# EAGLE design RAMPSSB (EAGLE 8.2.2)
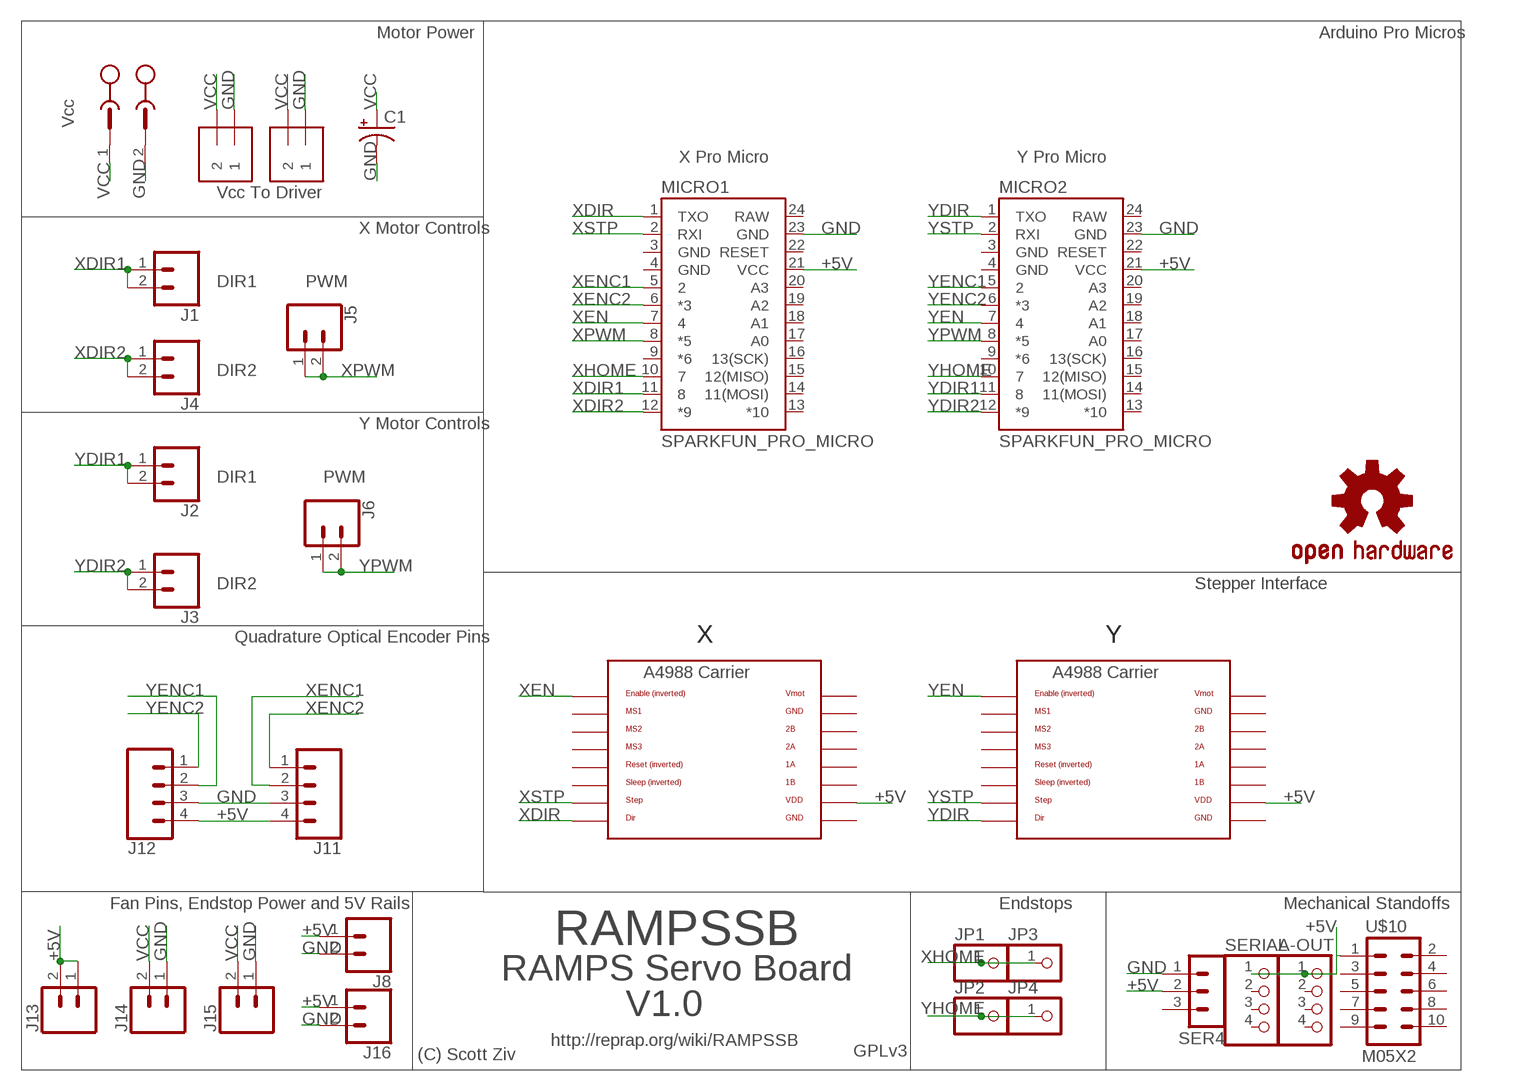
[diagram p0: schematic, sheet 1]

## Parts
A-OUT  PINHD-1X4  [1X04]
C1  CPOL-USE2.5-6  [E2,5-6]
J1  CONN_02  [1X02]
J2  CONN_02  [1X02]
J3  CONN_02  [1X02]
J4  CONN_02  [1X02]
J5  CONN_02  [1X02]
J6  CONN_02  [1X02]
J7  OSTTH020160  [EDSTL130-02]
J8  CONN_02  [1X02]
J9  1X2-3.5MM  [1X2-3.5MM]
J10  1X2-3.5MM  [1X2-3.5MM]
J11  CONN_04  [1X04]
J12  CONN_04  [1X04]
J13  CONN_02  [1X02]
J14  CONN_02  [1X02]
J15  CONN_02  [1X02]
J16  CONN_02  [1X02]
JP1  PINHD-1X1  [1X01]
JP2  PINHD-1X1  [1X01]
JP3  PINHD-1X1  [1X01]
JP4  PINHD-1X1  [1X01]
LOGO1  OSHW-LOGOL  [OSHW-LOGO-L]
MICRO1  SPARKFUN_PRO_MICRO  [SPARKFUN_PRO_MICRO]
MICRO2  SPARKFUN_PRO_MICRO  [SPARKFUN_PRO_MICRO]
SER4  3PIN-HEADER  [3PIN-HEADER]
SERIAL  PINHD-1X4  [1X04]
U$6  A4988BREAKOUT  [A4988BREAKOUT]
U$7  A4988BREAKOUT  [A4988BREAKOUT]
U$10  M05X2  [2X5]

## Nets
+5V: A-OUT.1 J8.1 J11.4 J12.4 J13.1 J13.2 J16.1 MICRO1.21(VCC) MICRO2.21(VCC) SER4.2 SERIAL.1 U$6.VDD U$7.VDD U$10.1
GND: C1.- J7.2 J8.2 J9.1 J10.1 J11.3 J12.3 J14.1 J15.1 J16.2 MICRO1.23(GND) MICRO2.23(GND) SER4.1
VCC: C1.+ J7.1 J9.2 J10.2 J14.2 J15.2
XDIR: MICRO1.1(TXO) U$6.DIR
XDIR1: J1.1 J1.2 MICRO1.11
XDIR2: J4.1 J4.2 MICRO1.12(*9)
XEN: MICRO1.7 U$6.EN
XENC1: J11.2 MICRO1.5
XENC2: J11.1 MICRO1.6(*3)
XHOME: JP1.1 JP3.1 MICRO1.10
XPWM: J5.1 J5.2 MICRO1.8(*5)
XSTP: MICRO1.2(RXI) U$6.STEP
YDIR: MICRO2.1(TXO) U$7.DIR
YDIR1: J2.1 J2.2 MICRO2.11
YDIR2: J3.1 J3.2 MICRO2.12(*9)
YEN: MICRO2.7 U$7.EN
YENC1: J12.2 MICRO2.5
YENC2: J12.1 MICRO2.6(*3)
YHOME: JP2.1 JP4.1 MICRO2.10
YPWM: J6.1 J6.2 MICRO2.8(*5)
YSTP: MICRO2.2(RXI) U$7.STEP
Unconnected: A-OUT.2 A-OUT.3 A-OUT.4 MICRO1.9(*6) MICRO1.13(*10) MICRO1.14(11(MOSI)) MICRO1.15(12(MISO)) MICRO1.16(13(SCK)) MICRO1.17(A0) MICRO1.18(A1) MICRO1.19(A2) MICRO1.20(A3) MICRO1.22(RESET) MICRO2.9(*6) MICRO2.13(*10) MICRO2.14(11(MOSI)) MICRO2.15(12(MISO)) MICRO2.16(13(SCK)) MICRO2.17(A0) MICRO2.18(A1) MICRO2.19(A2) MICRO2.20(A3) MICRO2.22(RESET) SER4.3 SERIAL.2 SERIAL.3 SERIAL.4 U$6.1A U$6.1B U$6.2A U$6.2B U$6.MS1 U$6.MS2 U$6.MS3 U$6.RST U$6.SLP(SLEEP) U$7.1A U$7.1B U$7.2A U$7.2B U$7.MS1 U$7.MS2 U$7.MS3 U$7.RST U$7.SLP(SLEEP) U$10.2 U$10.3 U$10.4 U$10.5 U$10.6 U$10.7 U$10.8 U$10.9 U$10.10

## Notes on the sheet
- Motor Power | Arduino Pro Micros
- Vcc
- X Pro Micro | Y Pro Micro
- Vcc To Driver
- X Motor Controls
- DIR1 | PWM
- DIR2
- Y Motor Controls
- DIR1 | PWM
- DIR2 | Stepper Interface
- Quadrature Optical Encoder Pins | X | Y
- Fan Pins, Endstop Power and 5V Rails | Endstops | Mechanical Standoffs
- RAMPSSB
- RAMPS Servo Board
- V1.0
- http://reprap.org/wiki/RAMPSSB
- (C) Scott Ziv | GPLv3

## Power pins joined to a net without a drawn wire
GND: MICRO1.3(GND) MICRO1.4(GND) MICRO2.3(GND) MICRO2.4(GND) U$6.GND U$6.GND@0(GND) U$7.GND U$7.GND@0(GND)
RAW: MICRO1.24(RAW) MICRO2.24(RAW)
VMOT: U$6.VMOT U$7.VMOT

## Library data of the parts
A-OUT SERIAL = RepRapjr:PINHD-1X4: PIN HEADER
C1 = adafruit:CPOL-US: POLARIZED CAPACITOR, American symbol
J1-J6 J8 J13-J16 = SparkFun-Retired:CONN_02: Multi connection point. Often used as Generic Header-pin footprint for 0.1 inch spaced/style header connections On any of the 0.1 inch spaced packages, you can populate with these: Break Away Headers - Straight <https://www.sparkfun.com/products/116> (PRT-00116) Break Away Male Headers - Right Angle <https://www.sparkfun.com/products/553> (PRT-00553) Female Headers <https://www.sparkfun.com/products/115> (PRT-00115) Break Away Headers - Machine Pin <https://www.sparkfun.com/products/117> (PRT-00117) Break Away Female Headers - Swiss Machine Pin <https://www.sparkfun.com/products/743> (PRT-00743) For SCREWTERMINALS and SPRING TERMINALS visit here: Screw Terimnals on SparkFun.com <https://www.sparkfun.com/search/results?term=Screw+Terminals> (5mm/3.5mm/2.54mm spacing) This device is also useful as a general connection point to wire up your design to another part of your project. Our various solder wires solder well into these plated through hole pads. Hook-Up Wire - Assortment (Stranded, 22 AWG) <https://www.sparkfun.com/products/11375> (PRT-11375) Hook-Up Wire - Assortment (Solid Core, 22 AWG) <https://www.sparkfun.com/products/11367> (PRT-11367) View the entire wire category on our website here <https://www.sparkfun.com/categories/141> Special notes: Molex polarized connector foot print use with: PRT-08233 with associated crimp pins and housings. 2.54_SCREWTERM for use with PRT-10571. 3.5mm Screw Terminal footprints for PRT-08084 5mm Screw Terminal footprints for use with PRT-08432
J7 = con-ost:OSTTH020160: 5mm Terminal Header
J9 J10 = adafruit:1X2: 3.5mm Terminal block http://www.ladyada.net/library/pcb/eaglelibrary.html
J11 J12 = SparkFun-Connectors:CONN_04: Multi connection point. Often used as Generic Header-pin footprint for 0.1 inch spaced/style header connections On any of the 0.1 inch spaced packages, you can populate with these: Break Away Headers - Straight <https://www.sparkfun.com/products/116> (PRT-00116) Break Away Male Headers - Right Angle <https://www.sparkfun.com/products/553> (PRT-00553) Female Headers <https://www.sparkfun.com/products/115> (PRT-00115) Break Away Headers - Machine Pin <https://www.sparkfun.com/products/117> (PRT-00117) Break Away Female Headers - Swiss Machine Pin <https://www.sparkfun.com/products/743> (PRT-00743) For SCREWTERMINALS and SPRING TERMINALS visit here: Screw Terimnals on SparkFun.com <https://www.sparkfun.com/search/results?term=Screw+Terminals> (5mm/3.5mm/2.54mm spacing) This device is also useful as a general connection point to wire up your design to another part of your project. Our various solder wires solder well into these plated through hole pads. Hook-Up Wire - Assortment (Stranded, 22 AWG) <https://www.sparkfun.com/products/11375> (PRT-11375) Hook-Up Wire - Assortment (Solid Core, 22 AWG) <https://www.sparkfun.com/products/11367> (PRT-11367) View the entire wire category on our website here <https://www.sparkfun.com/categories/141> Special notes: Molex polarized connector foot print use with SKU : PRT-08231 with associated crimp pins and housings. 1MM SMD Version SKU: PRT-10208; PROD_ID: CONN-09696
JP1-JP4 = adafruit:PINHD-1X1: Pin header 1x1 for 0.1" spacing With round pins
LOGO1 = SparkFun-Aesthetics:OSHW-LOGO: Open-Source Hardware (OSHW) Logo This logo indicates the piece of hardware it is found on incorporates a OSHW license and/or adheres to the definition of open source hardware found here: http://freedomdefined.org/OSHW
MICRO1 MICRO2 = SparkFun-Boards:SPARKFUN_PRO_MICRO: SparkFun Pro Micro Atmega32U4 compatible footprint. SparkFun Products: 3.3V/8MHz <https://www.sparkfun.com/products/12587> 5V/16MHz <https://www.sparkfun.com/products/12640>
SER4 = ultimachine:3PIN-HEADER: PIN HEADER
U$6 U$7 = RepRapjr:A4988BREAKOUT
U$10 = RepRapjr:M05X2

## Board
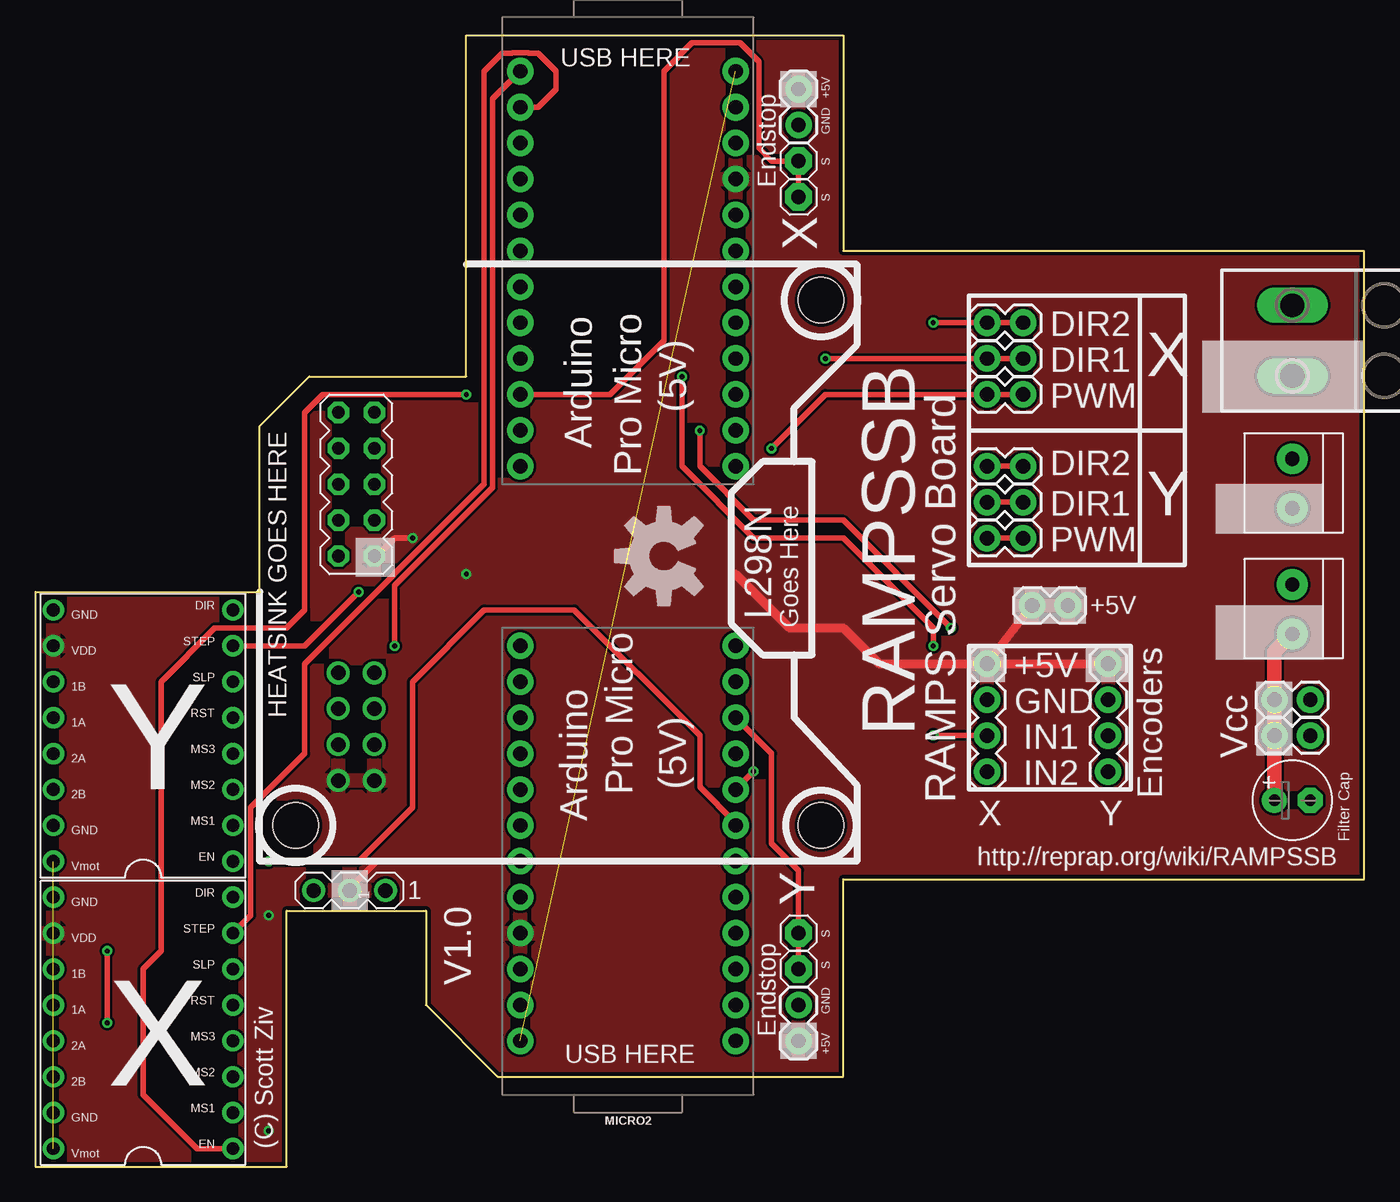
[diagram p1: board, top side]
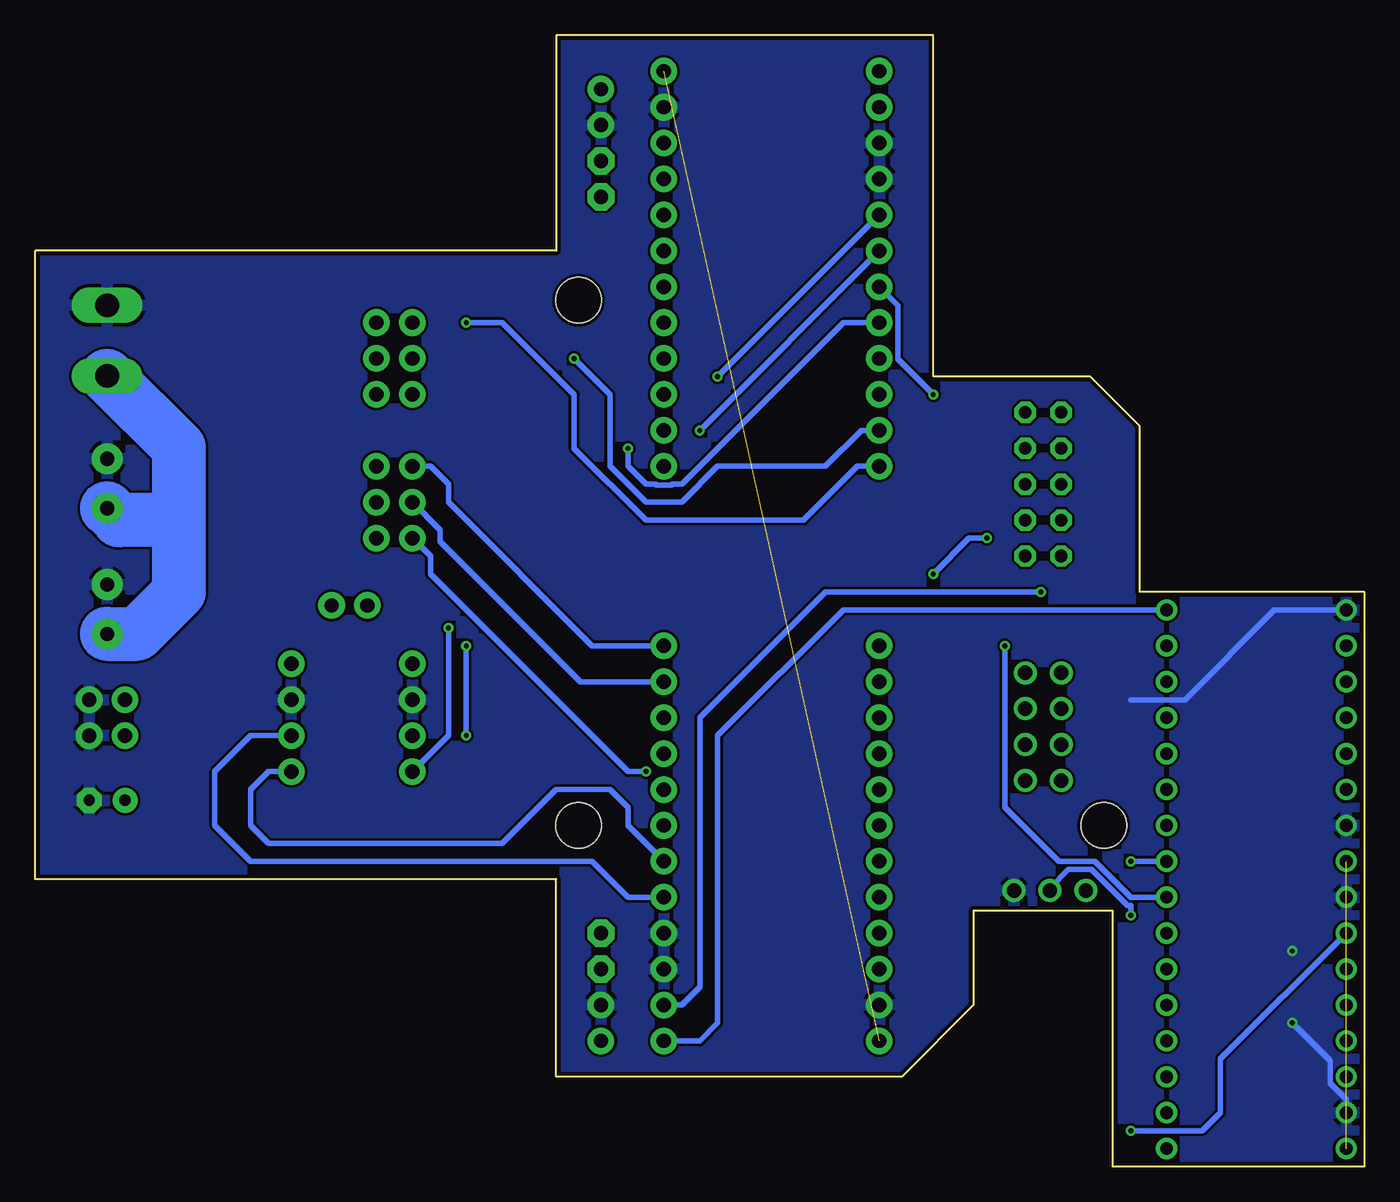
[diagram p2: board, bottom side, seen from below]

Size 93.98 x 80.01 mm. Coordinates in mm from the lower left corner, seen from the top.
Outline: 0,40.64 0,0 17.78,0 17.78,18.1 27.62,18.1 27.62,11.43 32.7,6.35 57.15,6.35 57.15,20.32 93.98,20.32 93.98,64.77 57.15,64.77 57.15,80.01 30.48,80.01 30.48,55.88 19.37,55.88 15.88,52.39 15.88,40.64 0,40.64
Copper layers (1*16): Top 0.035mm / dielectric 1.5mm / Bottom 0.035mm
Design rules "GoldPhoenix": minimum track width 7mil, minimum drill 15mil, track to track 7mil, track to pad 7mil, pad to pad 7mil, via to via 7mil, smd to smd 7mil, copper to edge 10mil, drill to drill 8mil, minimum pad ring 12mil, minimum via ring 7mil, stop-mask expansion 4mil, vias tented up to drill 25mil, thermal gap 10mil
Holes 3.2 mm at 18.41,24.13 55.56,24.13 55.56,61.28

### Footprints (pad centres in the part's own frame; a part is rotated, then mirrored left to right if it is on the bottom)
1X04 = drill 1.016: 1 -2.54,0; 2 0,0; 3 2.54,0; 4 5.08,0
E2,5-6 = drill 0.813 pad 1.778: + -1.27,0 | drill 0.813 pad 1.778 octagon: - 1.27,0
1X02 = drill 1.016 pad 1.88: 1 0,0; 2 2.54,0
EDSTL130-02 = drill 1.676 long: 1 -2.5,0; 2 2.5,0
1X2-3.5MM = drill 1 pad 2.184: 1 1.8,0; 2 -1.7,0
1X04' = drill 1.016 pad 1.88: 1 0,0; 2 2.54,0; 3 5.08,0; 4 7.62,0
1X01 = drill 1.016 pad 1.93 octagon: 1 0,0
SPARKFUN_PRO_MICRO = drill 1.016 pad 1.88: 1 -7.62,12.7; 2 -7.62,10.16; 3 -7.62,7.62; 4 -7.62,5.08; 5 -7.62,2.54; 6 -7.62,0; 7 -7.62,-2.54; 8 -7.62,-5.08; 9 -7.62,-7.62; 10 -7.62,-10.16; 11 -7.62,-12.7; 12 -7.62,-15.24; 13 7.62,-15.24; 14 7.62,-12.7; 15 7.62,-10.16; 16 7.62,-7.62; 17 7.62,-5.08; 18 7.62,-2.54; 19 7.62,0; 20 7.62,2.54; 21 7.62,5.08; 22 7.62,7.62; 23 7.62,10.16; 24 7.62,12.7
3PIN-HEADER = drill 1.016: 1 -2.54,0; 2 0,0; 3 2.54,0
A4988BREAKOUT = drill 0.9: 1A 8.89,1.27; 1B 11.43,1.27; 2A 6.35,1.27; 2B 3.81,1.27; DIR 16.51,-11.43; EN -1.27,-11.43; GND 16.51,1.27; GND@0 1.27,1.27; MS1 1.27,-11.43; MS2 3.81,-11.43; MS3 6.35,-11.43; RST 8.89,-11.43; SLP 11.43,-11.43; STEP 13.97,-11.43; VDD 13.97,1.27; VMOT -1.27,1.27
2X5 = drill 0.9 pad 1.422 octagon: 1 -3.81,-1.27; 2 -3.81,1.27; 3 -1.27,-1.27; 4 -1.27,1.27; 5 1.27,-1.27; 6 1.27,1.27; 7 3.81,-1.27; 8 3.81,1.27; 9 6.35,-1.27; 10 6.35,1.27

### Placement (x,y rotation side)
A-OUT  21.43,29.84 90 top
C1  88.9,25.91 0 top
J1  67.31,57.15 0 top
J2  67.31,46.99 0 top
J3  67.31,49.53 0 top
J4  67.31,59.69 0 top
J5  67.31,54.61 0 top
J6  67.31,44.45 0 top
J7  88.9,58.42 90 top
J8  53.98,8.89 90 top
J9  88.9,39.37 90 top
J10  88.9,48.26 90 top
J11  [1X04']  67.31,27.94 90 top
J12  [1X04']  75.88,27.94 90 top
J13  73.03,39.69 180 top
J14  90.17,33.02 180 top
J15  90.17,30.48 180 top
J16  53.98,76.2 270 top
JP1  53.98,71.12 0 top
JP2  53.98,16.51 0 top
JP3  53.98,68.58 0 top
JP4  53.98,13.97 0 top
LOGO1  44.45,43.18 90 top
MICRO1  41.91,64.77 0 top
MICRO2  41.91,21.59 180 top
SER4  22.23,19.53 180 top
SERIAL  23.97,29.84 90 top
U$6  2.54,2.54 90 top
U$7  2.54,22.86 90 top
U$10  22.7,46.99 90 top

### Tracks (layer width: path | path; a pad name or v marks a point on that pad's centre or on a via)
+5V  (via drill 0.35)
  Top 0.406: J11.4 67.11,35.56 | SER4.2 22.23,19.69 24.13,21.59 | U$10.1 24.13,43.18 25.4,44.45 v26.67,44.45
  Top 0.61: J12.4 J11.4 67.11,35.56 59.69,35.56 57.15,38.1 53.34,38.1 49.53,41.91 | J11.4 J13.2
  Bottom 0.406: U$6.VDD | U$6.VDD 10.16,7.62 10.16,3.81 11.43,2.54 v16.51,2.54 | SER4.2 22.23,19.69 20.9,21.01 19.29,21.01 16.75,18.47 16.51,18.47 v16.51,17.78 | v26.67,44.45 27.94,44.45 v30.48,41.91
  pour Top: 0,0 0,40.64 15.56,40.64 15.56,52.39 19.05,55.88 30.48,55.88 30.48,80.01 57.15,80.01 57.15,66.04 93.98,66.04 93.98,20.32 57.15,20.32 57.15,6.35 26.04,5.08 27.3,17.78 17.78,17.78 17.78,0
GND  (via drill 0.35)
  Top 0.406: v5.08,10.16 v5.08,15.24
  Bottom 0.406: U$7.GND 6.35,39.37 12.7,33.02 16.51,33.02 | U$6.GND@0 1.27,4.74 2.41,5.88 2.41,7.49 v5.08,10.16
  pour Bottom: 0,0 0,40.64 15.88,40.64 15.88,52.7 19.05,55.88 30.48,55.88 30.48,80.01 57.15,80.01 57.15,66.04 93.98,66.04 93.98,20.32 57.15,20.32 57.15,6.35 30.48,6.35 27.3,9.53 27.3,17.15 26.67,17.78 17.78,17.78 17.78,0
RAW  (1 unrouted)
VCC
  Top 1.016: J9.2 87.63,36.4 J14.2 J15.2 C1.+
  Bottom 3.81: J9.2 86.79,37.67 83.82,40.64 83.82,45.72 | 83.82,45.72 88.06,45.72 J10.2 | 83.82,45.72 83.82,50.84 J7.1
VMOT  (1 unrouted)
XDIR  (via drill 0.35)
  Top 0.406: 25.4,39.37 v25.4,36.83 25.4,41.08 32.33,48.02 32.33,75.51 MICRO1.1
  Bottom 0.406: U$6.DIR 16.51,19.05 19.05,21.59 21.59,21.59 25.4,25.4 v25.4,36.83
XDIR1  (via drill 0.35)
  Top 0.406: v55.88,57.15 J1.1 J1.2
  Bottom 0.406: MICRO1.11 35.56,52.07 38.1,49.53 45.72,49.53 48.26,46.99 50.8,46.99 53.34,49.53 53.34,54.61 v55.88,57.15
XDIR2  (via drill 0.35)
  Top 0.406: v63.5,59.69 J4.1 J4.2
  Bottom 0.406: v63.5,59.69 60.96,59.69 55.88,54.61 55.88,50.8 50.8,45.72 39.65,45.72 35.84,49.53 MICRO1.12
XEN  (via drill 0.35)
  Top 0.406: U$6.EN 11.43,1.27 7.62,5.08 7.62,13.97 8.89,15.24 8.89,34.29 12.7,38.1 17.78,38.1 19.05,39.37 19.05,53.34 20.32,54.61 v30.48,54.61
  Bottom 0.406: v30.48,54.61 32.97,57.1 32.97,60.91 MICRO1.7
XENC1  (via drill 0.35)
  Top 0.406: J11.2 v63.5,30.48 | v63.5,36.83 63.5,38.1 57.15,44.45 50.8,44.45 45.72,49.53 v45.72,55.88
  Bottom 0.406: v63.5,30.48 v63.5,36.83 | v45.72,55.88 MICRO1.5
XENC2  (via drill 0.35)
  Top 0.406: v64.77,38.1 57.15,45.72 50.8,45.72 46.99,49.53 v46.99,52.07
  Bottom 0.406: v64.77,38.1 64.77,30.48 J11.1 | MICRO1.6 v46.99,52.07
XHOME
  Top 0.406: MICRO1.10 40.64,54.61 44.45,58.42 44.45,77.47 46.46,79.48 49.82,79.48 51.17,78.13 51.17,72.02 52.07,71.12 JP1.1 JP3.1
XPWM  (via drill 0.35)
  Top 0.406: J5.2 J5.1 55.88,54.61 v52.07,50.8
  Bottom 0.406: MICRO1.8 36.83,59.69 48.26,48.26 48.93,48.26 48.98,48.21 50.08,48.21 50.13,48.26 50.8,48.26 52.07,49.53 v52.07,50.8
XSTP
  Top 0.406: U$6.STEP 15.24,17.78 15.24,25.4 19.05,29.21 19.05,35.56 31.75,48.26 31.75,77.47 33.02,78.74 33.69,78.74 33.74,78.79 34.84,78.79 34.89,78.74 35.56,78.74 36.83,77.47 36.83,76.2 35.56,74.93 MICRO1.2
YDIR
  Bottom 0.406: MICRO2.1 46.99,8.89 45.72,10.16 45.72,30.48 36.83,39.37 U$7.DIR
YDIR1
  Top 0.406: J2.2 J2.1
  Bottom 0.406: MICRO2.11 55.44,34.29 65.35,44.21 65.35,45.03 J2.1
YDIR2
  Top 0.406: J3.2 J3.1
  Bottom 0.406: MICRO2.12 54.61,36.83 64.77,46.99 64.77,48.26 66.04,49.53 J3.1
YEN  (via drill 0.35)
  Top 0.406: v16.51,21.59 22.86,21.59 26.67,25.4 26.67,34.29 31.75,39.37 38.1,39.37 46.99,30.48 46.99,26.86 49.53,24.32 MICRO2.7
  Bottom 0.406: U$7.EN v16.51,21.59
YENC1
  Bottom 0.406: MICRO2.5 52.07,19.05 54.61,21.59 78.74,21.59 81.28,24.13 81.28,27.94 78.74,30.48 J12.2
YENC2
  Bottom 0.406: J12.1 77.47,27.94 78.74,26.67 78.74,24.13 77.47,22.86 60.96,22.86 57.15,26.67 53.34,26.67 52.07,25.4 52.07,24.13 MICRO2.6
YHOME
  Top 0.406: MICRO2.10 52.07,29.21 52.07,22.86 53.98,20.95 JP2.1 JP4.1
YPWM  (via drill 0.35)
  Top 0.406: J6.2 J6.1 | MICRO2.8 v50.8,27.94
  Bottom 0.406: v50.8,27.94 52.07,27.94 66.04,41.91 66.04,43.18 J6.1
YSTP  (via drill 0.35)
  Top 0.406: v22.86,40.64 19.05,36.83 U$7.STEP
  Bottom 0.406: MICRO2.2 48.26,11.43 46.99,12.7 46.99,31.75 38.1,40.64 v22.86,40.64

### Text on the board
tPlace: USB HERE | Endstop | +5V | GND | S | S | X | DIR2 | X | DIR1 | (5V) | PWM | Arduino | Y | Pro Micro | DIR2 | DIR1 | PWM | L298N | +5V | Pro Micro | Goes Here | +5V | HEATSINK GOES HERE | GND | RAMPSSB | IN1 | Vcc | Y | (5V) | IN2 | RAMPS Servo Board | Encoders | Arduino | X | Y | http://reprap.org/wiki/RAMPSSB | Filter Cap | V1.0 | Y | S | S | GND | Endstop | USB HERE | +5V | X | (C) Scott Ziv
_tsilk: 1